# Altium project Calisma.PrjPcb
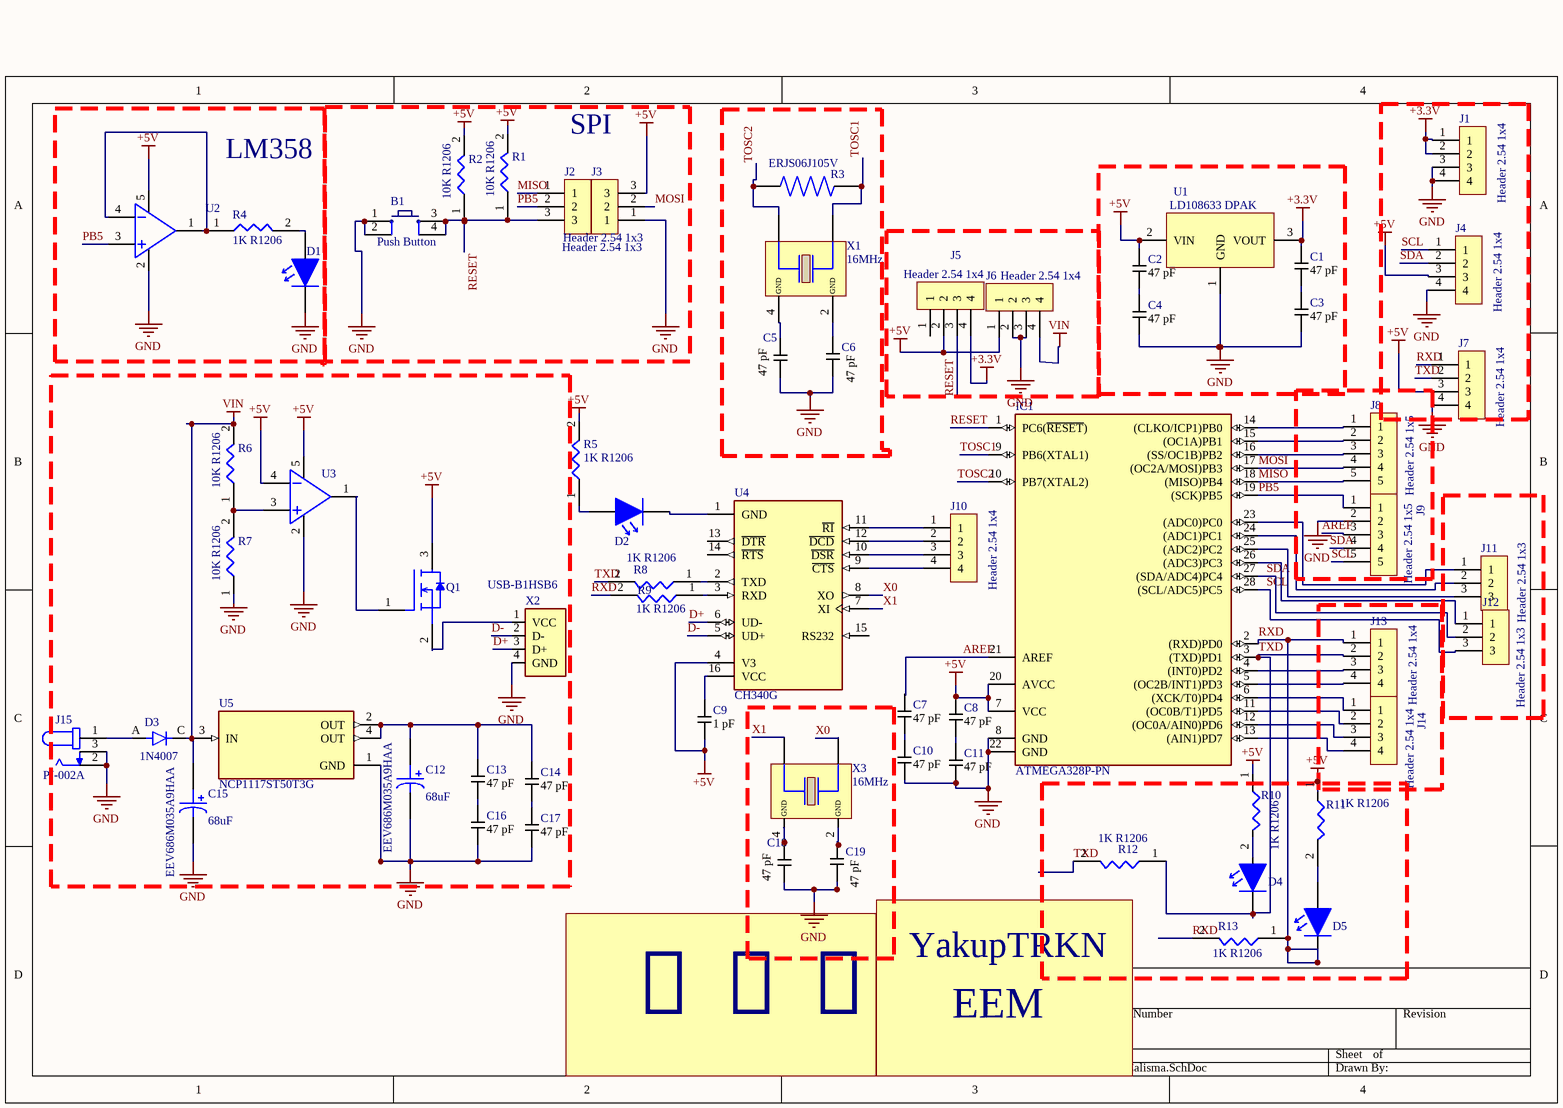
[diagram p0: Calisma.SchDoc]
1 sheet, 63 parts. Net scope: global (net labels, ports and power ports of the same name join across sheets).
Board files: Calisma.PcbDoc, CALISMA_!.PcbDoc

## Sheet Calisma.SchDoc
size A4

### Parts
B1  Push Button  [PUSB BUTTON-SMD]
C1  Capacitance: 47 pF  [SAMSUNG_CAP_0603_090]  (hidden comment: CL10C470JB8NNNC)
C2  Capacitance: 47 pF  [SAMSUNG_CAP_0603_090]  (hidden comment: CL10C470JB8NNNC)
C3  Capacitance: 47 pF  [SAMSUNG_CAP_0603_090]  (hidden comment: CL10C470JB8NNNC)
C4  Capacitance: 47 pF  [SAMSUNG_CAP_0603_090]  (hidden comment: CL10C470JB8NNNC)
C5  Capacitance: 47 pF  [SAMSUNG_CAP_0603_090]  (hidden comment: CL10C470JB8NNNC)
C6  Capacitance: 47 pF  [SAMSUNG_CAP_0603_090]  (hidden comment: CL10C470JB8NNNC)
C7  Capacitance: 47 pF  [SAMSUNG_CAP_0603_090]  (hidden comment: CL10C470JB8NNNC)
C8  Capacitance: 47 pF  [SAMSUNG_CAP_0603_090]  (hidden comment: CL10C470JB8NNNC)
C9  Capacitance: 1 pF  [SAMSUNG_CAP_0603_090]  (hidden comment: CL10C010BB8NNNC)
C10  Capacitance: 47 pF  [SAMSUNG_CAP_0603_090]  (hidden comment: CL10C470JB8NNNC)
C11  Capacitance: 47 pF  [SAMSUNG_CAP_0603_090]  (hidden comment: CL10C470JB8NNNC)
C12  EEV686M035A9HAA  Capacitance: 68uF  [CAP_EEVseries]
C13  Capacitance: 47 pF  [SAMSUNG_CAP_0603_090]  (hidden comment: CL10C470JB8NNNC)
C14  Capacitance: 47 pF  [SAMSUNG_CAP_0603_090]  (hidden comment: CL10C470JB8NNNC)
C15  EEV686M035A9HAA  Capacitance: 68uF  [CAP_EEVseries]
C16  Capacitance: 47 pF  [SAMSUNG_CAP_0603_090]  (hidden comment: CL10C470JB8NNNC)
C17  Capacitance: 47 pF  [SAMSUNG_CAP_0603_090]  (hidden comment: CL10C470JB8NNNC)
C18  Capacitance: 47 pF  [SAMSUNG_CAP_0603_090]  (hidden comment: CL10C470JB8NNNC)
C19  Capacitance: 47 pF  [SAMSUNG_CAP_0603_090]  (hidden comment: CL10C470JB8NNNC)
D1  LH R974-LP-1  [LED_RED_0805]  (value not drawn)
D2  LTST-C171GKT  [LED_GREEN_0805]  (value not drawn)
D3  1N4007  [DIOAD1060W80L520D270]
D4  LTST-C171GKT  [LED_GREEN_0805]  (value not drawn)
D5  LTST-C171GKT  [LED_GREEN_0805]  (value not drawn)
IC1  ATMEGA328P-PN  [DIL28]
J1  Header 2.54 1x4  [Header 2.54 1x4]
J2  Header 2.54 1x3  [Header 2.54 1x3]
J3  Header 2.54 1x3  [Header 2.54 1x3]
J4  Header 2.54 1x4  [Header 2.54 1x4]
J5  Header 2.54 1x4  [Header 2.54 1x4]
J6  Header 2.54 1x4  [Header 2.54 1x4]
J7  Header 2.54 1x4  [Header 2.54 1x4]
J8  Header 2.54 1x5  [Header 2.54 1x5]
J9  Header 2.54 1x5  [Header 2.54 1x5]
J10  Header 2.54 1x4  [Header 2.54 1x4]
J11  Header 2.54 1x3  [Header 2.54 1x3]
J12  Header 2.54 1x3  [Header 2.54 1x3]
J13  Header 2.54 1x4  [Header 2.54 1x4]
J14  Header 2.54 1x4  [Header 2.54 1x4]
J15  PJ-002A  [CUI_PJ-002A]
Q1  SSM3K357R,LF  [SOT-23F]  (value not drawn)
R1  10K R1206  [R1206 Resıstor]
R2  10K R1206  [R1206 Resıstor]
R3  ERJS06J105V  [RES_ERJS06J105V]
R4  1K R1206  [R1206 Resıstor]
R5  1K R1206  [R1206 Resıstor]
R6  10K R1206  [R1206 Resıstor]
R7  10K R1206  [R1206 Resıstor]
R8  1K R1206  [R1206 Resıstor]
R9  1K R1206  [R1206 Resıstor]
R10  1K R1206  [R1206 Resıstor]
R11  1K R1206  [R1206 Resıstor]
R12  1K R1206  [R1206 Resıstor]
R13  1K R1206  [R1206 Resıstor]
U1  LD108633 DPAK  [DPAK228P972X230-3N]
U2  OPA314AIDBVR  [SOT23-5]  (value not drawn)
U3  OPA314AIDBVR  [SOT23-5]  (value not drawn)
U4  CH340G  [SOIC127P600X180-16N]
U5  NCP1117ST50T3G  [SOT230P700X180-4N]
X1  Frequency: 16MHz  [ECS]  (hidden comment: ECS-160-20-30B-TR)
X2  USB-B1HSB6  [OST_USB-B1HSB6]
X3  Frequency: 16MHz  [ECS]  (hidden comment: ECS-160-20-30B-TR)

### Nets
+3.3V: C1.2 J1.1 J1.2 J5.4 U1.3(VOUT)
+5V: C2.2 C8.2 C9.1 IC1.7(VCC) IC1.20(AVCC) J3.3 J4.3 J5.2 J6.1 J7.3 Q1.3(D) R1.2 R2.2 R5.2 R10.1 R11.1 U1.2(VIN) U2.5 U3.4 U3.5 U4.4(V3)
GND: B1.1 B1.2 C3.1 C4.1 C5.1 C6.1 C10.1 C11.1 C12.2 C15.2 C16.1 C17.1 C18.1 C19.1 D1.1 IC1.8(GND) IC1.22(GND) J1.3 J1.4 J3.1 J4.4 J6.2 J6.3 J7.4 J9.2 J15.2 J15.3 R7.1 U1.1(GND) U2.2 U3.2 U5.1(GND) X2.4(GND)
VIN: C15.1 D3.C J6.4 R6.2 U5.3(IN)
AREF: IC1.21(AREF) J9.3
D+: U4.6(UD-) X2.3(D+)
D-: U4.5(UD+) X2.2(D-)
MISO: IC1.18((MISO)PB4) J2.1 J8.5
MOSI: IC1.17((OC2A/MOSI)PB3) J3.2 J8.4
PB5: IC1.19((SCK)PB5) J2.2 J9.1 U2.3
RESET: B1.3 B1.4 IC1.1(PC6(~{RESET})) J2.3 J5.3 R1.1 R2.1
RXD: D5.1 IC1.2((RXD)PD0) J7.1 J13.1 R9.2 R13.1 R13.2
SCL: IC1.28((SCL/ADC5)PC5) J4.1 J9.5 J12.3
SDA: IC1.27((SDA/ADC4)PC4) J4.2 J9.4 J12.2
TOSC1: IC1.9(PB6(XTAL1)) R3.2 X1.1
TOSC2: IC1.10(PB7(XTAL2)) R3.1 X1.3
TXD: D4.1 IC1.3((TXD)PD1) J7.2 J13.2 R8.2 R12.1 R12.2
X0: U4.8(XO) X3.1
X1: U4.7(XI) X3.3
NetC1_1: C1.1 C3.2
NetC2_1: C2.1 C4.2
NetC5_2: C5.2 X1.4(GND)
NetC6_2: C6.2 X1.2(GND)
NetC7_1: C7.1 C10.2
NetC8_1: C8.1 C11.2
NetC9_2: C9.2 U4.16(VCC)
NetC12_1: C12.1 C13.2 C14.2 U5.2(OUT) U5.4(OUT)
NetC13_1: C13.1 C16.2
NetC14_1: C14.1 C17.2
NetC18_2: C18.2 X3.4(GND)
NetC19_2: C19.2 X3.2(GND)
NetD1_2: D1.2 R4.2
NetD2_1: D2.1 U4.1(GND)
NetD2_2: D2.2 R5.1
NetD3_A: D3.A J15.1
NetD4_2: D4.2 R10.2
NetD5_2: D5.2 R11.2
NetIC1_4: IC1.4((INT0)PD2) J13.3
NetIC1_5: IC1.5((OC2B/INT1)PD3) J13.4
NetIC1_6: IC1.6((XCK/T0)PD4) J14.1
NetIC1_11: IC1.11((OC0B/T1)PD5) J14.2
NetIC1_12: IC1.12((OC0A/AIN0)PD6) J14.3
NetIC1_13: IC1.13((AIN1)PD7) J14.4
NetIC1_14: IC1.14((CLKO/ICP1)PB0) J8.1
NetIC1_15: IC1.15((OC1A)PB1) J8.2
NetIC1_16: IC1.16((SS/OC1B)PB2) J8.3
NetIC1_23: IC1.23((ADC0)PC0) J11.1
NetIC1_24: IC1.24((ADC1)PC1) J11.2
NetIC1_25: IC1.25((ADC2)PC2) J11.3
NetIC1_26: IC1.26((ADC3)PC3) J12.1
NetJ10_1: J10.1 U4.11(~{RI})
NetJ10_2: J10.2 U4.12(~{DCD})
NetJ10_3: J10.3 U4.10(~{DSR})
NetJ10_4: J10.4 U4.9(~{CTS})
NetQ1_1: Q1.1(G) U3.1
NetQ1_2: Q1.2(S) X2.1(VCC)
NetR4_1: R4.1 U2.1 U2.4
NetR6_1: R6.1 R7.2 U3.3
NetR8_1: R8.1 U4.2(TXD)
NetR9_1: R9.1 U4.3(RXD)

Not connected (* = marked no-connect by the designer): C7 2; J5 1; U4 13(~{DTR}) 14(~{RTS}) 15(RS232)

### Notes on the sheet
- LM358
- SPI
- YakupTRKN
- 𐱅𐰇𐰼𐰰
- EEM

### Library data of the parts
B1 = Push Button: Smd Push Button; Satın Alma Linki: https://urun.n11.com/diger/mini-pushbutton-switch-smd-P227461537?gclid=Cj0KCQjwkoDmBRCcARIsAG3xzl8Y_-jeD7HocNM6lvuZ_rVp83568XPGtNzlPwXWLph8oCRqo0yh87UaApZYEALw_wcB&gclsrc=aw.ds
C1-C8 C10 C11 C13 C14 C16-C19 = CL10C470JB8NNNC: CAP CER 47PF 50V C0G/NP0 0603; Supplier 1: Digi-Key; Supplier 2: Farnell; Supplier 3: Mouser; Supplier Part Number 1: 1276-1037-1-ND; Supplier Part Number 2: 3013448; Supplier Part Number 3: 187-CL10C470JB8NNNC
C9 = CL10C010BB8NNNC: CAP CER 1PF 50V C0G/NP0 0603; Supplier 1: Digi-Key; Supplier 2: Arrow Electronics; Supplier Part Number 1: 1276-1095-1-ND; Supplier Part Number 2: CL10C010BB8NNNC
C12 C15 = CAP ALU 68uF: Cap Aluminum Lytic 68uF 35V 20% (6.3 X 7.7mm) SMD 280mA 2000h 105C T/R; Manufacturer: KEMET; Impedance: 340mR; Ripple Current: 196mA; Life (Hours): 2000Hour; Designator by: BERK; Supplier 1: Digi-Key; Manufacturer Part Number: EEV686M035A9HAA; RoHS: Yes; Category: Aluminum Electrolytic Capacitors; Stock 1: 543; Pricing 1: 1=0,54000, 10=0,38000, 50=0,28740, 100=0,25040, 500=0,18546 (USD); Mount: Surface Mount; Case/Package: Radial; Min Operating Temperature: -40°C; Max Operating Temperature: 105°C; Packaging: Tape and Reel; Package Quantity: 1; Voltage Rating: 35V; Tolerance: 20%; Voltage Rating (DC): 35V; Termination: SMD/SMT; Series: EEV; Length: 7.7mm; Height - Seated (Max): 0.315inch; RoHS Compliant: Yes; ComponentLink1URL: https://datasheet.ciiva.com/5365/kem-a4002-eev-535332-5365784.pdf?src-supplier=Mouser; ComponentLink1Description: https://datasheet.ciiva.com/5365/kem-a4002-eev-535332-5365784.pdf?src-supplier=Mouser; Supplier Part Number 1: 399-6722-1-ND
D1 = LED RED 0805: LED Uni-Color Hyper Red 660nm 2-Pin Chip 0805(2012Metric) T/R; Manufacturer: Osram Opto; Lens Color: White; Forward Voltage: 1.8V; Lens Style: Diffused,Flat,Colorless; Luminous Intensity: 71mcd; Viewing Angle: 160°; Forward Current: 30mA; Dominant Wavelength: 645nm; Number of Elements: 1; Test Current: 20mA; Reverse Voltage: 5V; Lens Transparency: Diffused; Luminous Flux: 0.17lm; Lens Size: 1.25mm; Designed by: BERK; Supplier 1: Digi-Key; Manufacturer Part Number: LH R974-LP-1; RoHS: Yes; Category: LEDs; Stock 1: 35632; Pricing 1: 1=0,26000, 10=0,13900, 100=0,06480, 500=0,05978, 1000=0,04683, 2000=0,04584 (USD); Mount: Surface Mount; Case/Package: 0805; Number of Pins: 2; Color: Red; Case Code (Imperial): 0805; Case Code (Metric): 2012; Min Operating Temperature: -30°C; Max Operating Temperature: 85°C; Packaging: Tape and Reel; Illumination Color: Red; Package Quantity: 1; Series: CHipLED; Length: 2.1mm; Width: 1.25mm; Depth: 1.35mm; Radiation Hardening: No; RoHS Compliant: Yes; ComponentLink1URL: http://www.jameco.com/Jameco/Products/ProdDS/2085634.pdf?src-supplier=Jameco; ComponentLink1Description: http://www.jameco.com/Jameco/Products/ProdDS/2085634.pdf?src-supplier=Jameco; ComponentLink2URL: http://components.arrow.com/part/dataview/0323_01825492?src-supplier=Arrow+Europe; ComponentLink2Description: http://components.arrow.com/part/dataview/0323_01825492?src-supplier=Arrow+Europe; ComponentLink3URL: https://dammedia.osram.info/media/resource/hires/osram-dam-2493888/LH%20R974.pdf?src-supplier=Digi-Key; ComponentLink3Description: https://dammedia.osram.info/media/resource/hires/osram-dam-2493888/LH%20R974.pdf?src-supplier=Digi-Key; ComponentLink4URL: http://www.mouser.com/ds/2/311/LH%20R974%20-%20CHIPLED%200805-318659.pdf?src-supplier=Mouser; ComponentLink4Description: http://www.mouser.com/ds/2/311/LH%20R974%20-%20CHIPLED%200805-318659.pdf?src-supplier=Mouser; ComponentLink5URL: https://www.verical.com/server-webapp/html/getDatasheet?partID=258950&src-supplier=Verical; ComponentLink5Description: https://www.verical.com/server-webapp/html/getDatasheet?partID=258950&src-supplier=Verical; ComponentLink6URL: http://components.arrow.com/part/dataview/41971690S1077610N9133?src-supplier=Arrow+Electronics; ComponentLink6Description: http://components.arrow.com/part/dataview/41971690S1077610N9133?src-supplier=Arrow+Electronics; ComponentLink7URL: http://components.arrow.com/part/dataview/41971690S6190115N2128?src-supplier=Arrow+Electronics; ComponentLink7Description: http://components.arrow.com/part/dataview/41971690S6190115N2128?src-supplier=Arrow+Electronics; Supplier Part Number 1: 475-1415-1-ND
D2 D4 D5 = LED GREEN 0805: Green 0805 130 º Min 5 mcd Typical 12 mcd Water Clear Lens SMT LED; Manufacturer: Vishay Lite-On; Designed by: BERK; Lens Color: Colorless; Viewing Angle: 130°; Lens Style: Diffused,Colorless,Rectangular,Clear; Luminous Intensity: 12mcd; Forward Current: 30mA; Forward Voltage: 2.1V; Power Rating: 100mW; Dominant Wavelength: 569nm; Test Current: 10mA; Number of Elements: 1; Wavelength: 585nm; Reverse Voltage: 5V; Supplier 1: Digi-Key; Manufacturer Part Number: LTST-C171GKT; RoHS: Yes; Category: LEDs; Stock 1: 159023; Pricing 1: 1=0,26000, 10=0,14100, 100=0,06560, 500=0,06060, 1000=0,04747 (USD); Mount: Surface Mount; Case/Package: 0805; Number of Pins: 2; Color: Green; Case Code (Metric): 2012; Case Code (Imperial): 0805; Min Operating Temperature: -55°C; Max Operating Temperature: 85°C; Package Quantity: 1; Packaging: Tape and Reel; Illumination Color: Green; Lens Transparency: Clear; Power Dissipation: 100mW; Number of LEDs: 1; Series: CHIPLED 0805; Length: 2mm; Width: 1.25mm; Height: 0.8mm; Depth: 1.25mm; Radiation Hardening: No; Lead Free: Lead Free; RoHS Compliant: Yes; ComponentLink1URL: https://datasheet.ciiva.com/2110/ltst-c171gkt-2110000.pdf?src-supplier=Digi-Key; ComponentLink1Description: https://datasheet.ciiva.com/2110/ltst-c171gkt-2110000.pdf?src-supplier=Digi-Key; ComponentLink2URL: https://datasheet.ciiva.com/11773/0900766b80dc0296-11773991.pdf?src-supplier=RSComponents; ComponentLink2Description: https://datasheet.ciiva.com/11773/0900766b80dc0296-11773991.pdf?src-supplier=RSComponents; ComponentLink3URL: https://datasheet.ciiva.com/12400/lite-on-ltst-c171gkt-190133-12400647.pdf?src-supplier=Mouser; ComponentLink3Description: https://datasheet.ciiva.com/12400/lite-on-ltst-c171gkt-190133-12400647.pdf?src-supplier=Mouser; ComponentLink4URL: https://datasheet.ciiva.com/2110/ltst-c171gkt-2110001.pdf?src-supplier=Digi-Key; ComponentLink4Description: https://datasheet.ciiva.com/2110/ltst-c171gkt-2110001.pdf?src-supplier=Digi-Key; ComponentLink5URL: https://datasheet.ciiva.com/2110/ltst-c171gkt-2110002.pdf?src-supplier=Digi-Key; ComponentLink5Description: https://datasheet.ciiva.com/2110/ltst-c171gkt-2110002.pdf?src-supplier=Digi-Key; ComponentLink6URL: https://datasheet.ciiva.com/16396/ltst-c171gkt-16396549.pdf?src-supplier=Future+Electronics; ComponentLink6Description: https://datasheet.ciiva.com/16396/ltst-c171gkt-16396549.pdf?src-supplier=Future+Electronics; Supplier Part Number 1: 160-1423-1-ND
D3 = 1N4007: Diode Switching 1KV 1A 2-Pin DO-41; MF: {'manufacturer': u'ON Semiconductor'}; MP: 1N4007; Availability: Unavailable; Value: *; Package: None; Price: None
IC1 = ATMEGA328P-PN: Atmel ATmega48/88/168/328 AVR Microcontroller; MF: {'manufacturer': u'Microchip'}; Availability: Unavailable; MP: ATMEGA328P-PN; Price: None; Package: None; Value: *
J15 = PJ-002A: 2.0 mm Center Pin, 2.5 A, Right Angle, Through Hole, Dc Power Jack Connector; MF: {'manufacturer': u'CUI Devices'}; Value: *; MP: PJ-002A; Package: None; Price: None; Availability: Unavailable
Q1 = SSM3K357R,LF: X34 SMALL LOW ON RESISTANCE MOSF; Manufacturer: Toshiba; Designed by: BERK; Supplier 1: Digi-Key; Manufacturer Part Number: SSM3K357R,LF; RoHS: No; Stock 1: 4170; Pricing 1: 1=0,41000, 10=0,32200, 25=0,30760, 100=0,19300, 500=0,17876, 1000=0,12155 (USD); ComponentLink1URL: https://toshiba.semicon-storage.com/info/docget.jsp?did=59207&prodName=SSM3K357R&src-supplier=Digi-Key; ComponentLink1Description: https://toshiba.semicon-storage.com/info/docget.jsp?did=59207&prodName=SSM3K357R&src-supplier=Digi-Key; Supplier Part Number 1: SSM3K357RLFCT-ND; Case/Package: SOT-23F
R3 = ERJS06J105V: MF: {'manufacturer': u'Panasonic'}; Package: None; MP: ERJS06J105V; Price: None; Availability: Unavailable; Value: *
U1 = LD108633 DPAK: LD1086 3.3V REGULATOR
U2 U3 = OPA314: Op Amp OPA314; Manufacturer: Texas Instruments; Designed by: BERK; Min Supply Voltage: 1.8V; Max Supply Voltage: 5.5V; Min Dual Supply Voltage: 900mV; Max Dual Supply Voltage: 2.75V; Voltage Gain: 128dB; Common Mode Rejection Ratio: 75dB; Gain Bandwidth Product: 3MHz; Output Current: 20mA; Nominal Supply Current: 150uA; Number of Channels: 1; Slew Rate: 1.5V/µs; Max I/O Voltage: 2.5mV; Input Bias Current: 10pA; Power Supply Rejection Ratio (PSRR): 78dB; Amplifier Type: GENERAL PURPOSE; Supplier 1: Digi-Key; Manufacturer Part Number: OPA314AIDBVR; RoHS: Yes; Category: Amplifiers - Op Amps, Buffer, Instrumentation; Stock 1: 964; Pricing 1: 1=1,06000, 10=0,95100, 25=0,90240, 100=0,69280, 250=0,61224, 500=0,58004, 1000=0,45114 (USD); Case/Package: SOT-23-5; Number of Pins: 5; Contact Plating: Gold; Min Operating Temperature: -40°C; Max Operating Temperature: 125°C; Package Quantity: 1; Packaging: Tape and Reel; Unity Gain Bandwidth Product: 3MHz; Nominal Gain Bandwidth Product: 3MHz; Input Offset Voltage (Vos): 2.5mV; Operating Supply Current: 150uA; Number of Circuits: 1; Output Current per Channel: 20mA; Number of Elements: 1; Supply Current: 150uA; Series: -; Technology: CMOS; Radiation Hardening: No; Lead Free: Lead Free; RoHS Compliant: Yes; ComponentLink1URL: https://datasheet.ciiva.com/14462/opa2314-14462006.pdf?src-supplier=Avnet; ComponentLink1Description: https://datasheet.ciiva.com/14462/opa2314-14462006.pdf?src-supplier=Avnet; ComponentLink2URL: https://datasheet.ciiva.com/26226/opa2314-26226295.pdf?src-supplier=Avnet+Europe; ComponentLink2Description: https://datasheet.ciiva.com/26226/opa2314-26226295.pdf?src-supplier=Avnet+Europe; ComponentLink3URL: https://datasheet.ciiva.com/14456/opa2314-14456281.pdf?src-supplier=Avnet; ComponentLink3Description: https://datasheet.ciiva.com/14456/opa2314-14456281.pdf?src-supplier=Avnet; ComponentLink4URL: https://datasheet.ciiva.com/29638/opa314-29638827.pdf?src-supplier=Digi-Key; ComponentLink4Description: https://datasheet.ciiva.com/29638/opa314-29638827.pdf?src-supplier=Digi-Key; Supplier Part Number 1: 296-36699-1-ND
U4 = CH340G: MF: {'manufacturer': u'WCH'}; Value: *; MP: CH340G; Availability: Unavailable; Package: None; Price: None
U5 = NCP1117ST50T3G: 1.0 A Low-Dropout Positive ,Fixed and Adjustable,Voltage Regulators; MF: {'manufacturer': u'ON Semiconductor'}; Package: None; MP: NCP1117ST50T3G; Price: None; Availability: Unavailable; Value: *
X1 X3 = CRYSTAL 16MHz: CRYSTAL 16.0000MHZ 20PF SMD; Manufacturer: ECS International; Designed by: BERK; Frequency Tolerance: 30ppm; ESR (Equivalent Series Resistance): 50R; Frequency Stability: 50ppm; Supplier 1: Digi-Key; Manufacturer Part Number: ECS-160-20-30B-TR; RoHS: Yes; Category: Crystals; Stock 1: 15303; Pricing 1: 1=1,33000, 10=1,26800, 50=1,23900, 100=1,06200, 500=1,03250 (USD); Mount: Surface Mount; Case/Package: SMD/SMT; Min Operating Temperature: -20°C; Max Operating Temperature: 70°C; Package Quantity: 1; Load Capacitance: 20pF; Packaging: Tape and Reel; Tolerance: 50ppm; Termination: SMD/SMT; Series: ECX-53B; Length: 0.197inch; Width: 0.126inch; Height: 0.033inch; Lead Free: Lead Free; RoHS Compliant: Yes; ComponentLink1URL: https://datasheet.ciiva.com/853/ecx-53b-853408.pdf?src-supplier=Digi-Key; ComponentLink1Description: https://datasheet.ciiva.com/853/ecx-53b-853408.pdf?src-supplier=Digi-Key; ComponentLink2URL: https://datasheet.ciiva.com/853/ecx-53b-853406.pdf?src-supplier=Digi-Key; ComponentLink2Description: https://datasheet.ciiva.com/853/ecx-53b-853406.pdf?src-supplier=Digi-Key; ComponentLink3URL: https://datasheet.ciiva.com/853/ecx-53b-853407.pdf?src-supplier=Digi-Key; ComponentLink3Description: https://datasheet.ciiva.com/853/ecx-53b-853407.pdf?src-supplier=Digi-Key; Supplier Part Number 1: XC1120CT-ND
X2 = USB-B1HSB6: Conn Usb Type b r/a Black; MF: {'manufacturer': u'On Shore'}; Availability: Unavailable; MP: USB-B1HSB6; Price: None; Package: None; Value: *